# Altium schematic sheet Main.SchDoc
size A
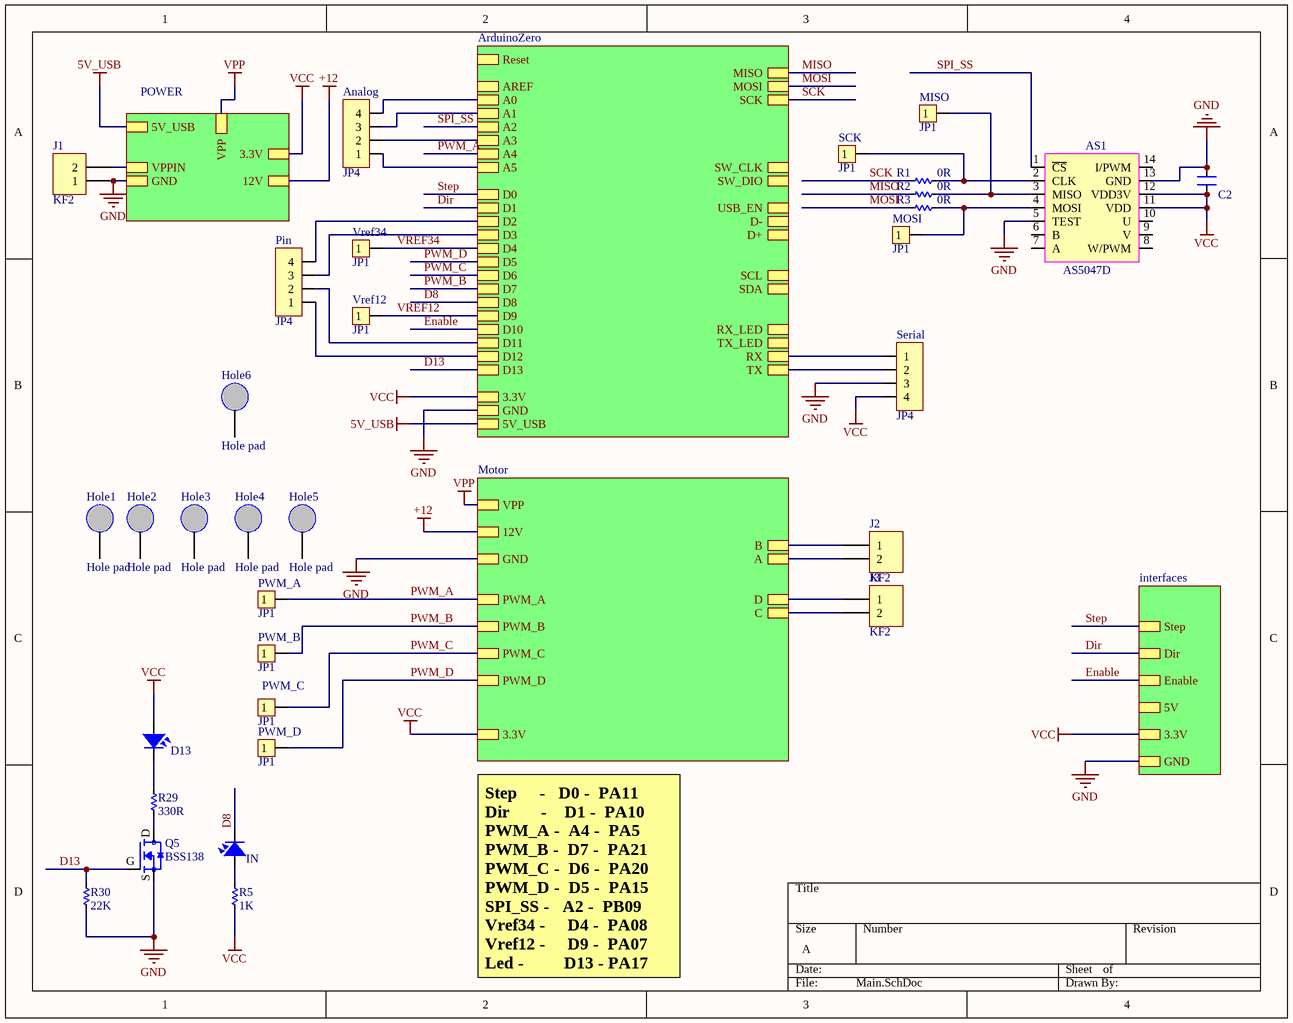
[diagram p0: Main.SchDoc]

## Parts
Analog  JP4  [JP4-C1T]
AS1  AS5047D  [AS5047D_Module]
C2  CN  [CN-SMD-0603_big]  (value not drawn)
D13  LED  [LED-0805-Blue]  (value not drawn)
Hole1  Hole pad  [HolePad]
Hole2  Hole pad  [HolePad]
Hole3  Hole pad  [HolePad]
Hole4  Hole pad  [HolePad]
Hole5  Hole pad  [HolePad]
Hole6  Hole pad  [HolePad]
IN  LED  [LED-0805-Blue]  (value not drawn)
J1  KF2  [KF2-5.08T]
J2  KF2  [KF2-5.08T]
J3  KF2  [KF2-5.08T]
MISO  JP1  [JP1-D1T]
MOSI  JP1  [JP1-D1T]
Pin  JP4  [JP4-C1T]
PWM_A  JP1  [JP1-D1T]
PWM_B  JP1  [JP1-D1T]
PWM_C  JP1  [JP1-D1T]
PWM_D  JP1  [JP1-D1T]
Q5  BSS138  [SOT23-bss138]
R1  0R  [RES-SMD-0603_BIG]
R2  0R  [RES-SMD-0603_BIG]
R3  0R  [RES-SMD-0603_BIG]
R5  1K  [RES-SMD-0603_BIG]
R29  330R  [RES-SMD-0603_BIG]
R30  22K  [RES-SMD-0603_BIG]
SCK  JP1  [JP1-D1T]
Serial  JP4  [JP4-C1T]
Vref12  JP1  [JP1-D1T]
Vref34  JP1  [JP1-D1T]

## Sub-sheets
ArduinoZero = ArduinoZero: Reset, A0, A1, A2, A3, A4, A5, D0, D1, D2, D3, D4, AREF, D5, D6, D7, D8, D9, D10, D11, D12, D13, TX, RX, TX_LED, RX_LED, SDA, SCL, 3.3V, GND, D+, D-, USB_EN, SW_DIO, SW_CLK, MISO, MOSI, SCK, 5V_USB
Interfaces = interfaces: Step, Dir, Enable, 5V, 3.3V, GND
Motor = Motor: VPP, 12V, GND, A, B, C, D, PWM_B, PWM_A, PWM_C, PWM_D, 3.3V
Power = POWER: 5V_USB, 3.3V, GND, VPPIN, 12V, VPP

## Nets
5V_USB: sheet ArduinoZero/5V_USB, sheet Power/5V_USB
+12: sheet Power/12V, sheet Motor/12V
GND: AS1.5(TEST) AS1.13(GND) C2.2 J1.1 Q5.S R30.1 Serial.3 ; sheet ArduinoZero/GND, sheet Interfaces/GND, sheet Power/GND, sheet Motor/GND
VCC: AS1.11(VDD) AS1.12(VDD3V) C2.1 D13.1 R5.2 Serial.4 ; sheet ArduinoZero/3.3V, sheet Interfaces/3.3V, sheet Power/3.3V, sheet Motor/3.3V
VPP: sheet Power/VPP, sheet Motor/VPP
D8: IN.2 ; sheet ArduinoZero/D8
D13: Q5.G R30.2 ; sheet ArduinoZero/D13
Dir: sheet ArduinoZero/D1, sheet Interfaces/Dir
Enable: sheet ArduinoZero/D10, sheet Interfaces/Enable
MISO: R2.2 ; sheet ArduinoZero/MISO
MOSI: R3.2 ; sheet ArduinoZero/MOSI
PWM_A: PWM_A.1 ; sheet ArduinoZero/A4, sheet Motor/PWM_A
PWM_B: PWM_B.1 ; sheet ArduinoZero/D7, sheet Motor/PWM_B
PWM_C: PWM_C.1 ; sheet ArduinoZero/D6, sheet Motor/PWM_C
PWM_D: PWM_D.1 ; sheet ArduinoZero/D5, sheet Motor/PWM_D
SCK: R1.2 ; sheet ArduinoZero/SCK
SPI_SS: AS1.1(~{CS}) ; sheet ArduinoZero/A2
Step: sheet ArduinoZero/D0, sheet Interfaces/Step
VREF12: Vref12.1 ; sheet ArduinoZero/D9
VREF34: Vref34.1 ; sheet ArduinoZero/D4
NetAnalog_1: Analog.1 ; sheet ArduinoZero/A5
NetAnalog_2: Analog.2 ; sheet ArduinoZero/A3
NetAnalog_3: Analog.3 ; sheet ArduinoZero/A1
NetAnalog_4: Analog.4 ; sheet ArduinoZero/A0
NetAS1_2: AS1.2(CLK) R1.1 SCK.1
NetAS1_3: AS1.3(MISO) MISO.1 R2.1
NetAS1_4: AS1.4(MOSI) MOSI.1 R3.1
NetD13_2: D13.2 R29.1
NetIN_1: IN.1 R5.1
NetJ1_2: J1.2 ; sheet Power/VPPIN
NetJ2_1: J2.1 ; sheet Motor/B
NetJ2_2: J2.2 ; sheet Motor/A
NetJ3_1: J3.1 ; sheet Motor/D
NetJ3_2: J3.2 ; sheet Motor/C
NetPin_1: Pin.1 ; sheet ArduinoZero/D12
NetPin_2: Pin.2 ; sheet ArduinoZero/D11
NetPin_3: Pin.3 ; sheet ArduinoZero/D3
NetPin_4: Pin.4 ; sheet ArduinoZero/D2
NetQ5_D: Q5.D R29.2
NetSerial_1: Serial.1 ; sheet ArduinoZero/RX
NetSerial_2: Serial.2 ; sheet ArduinoZero/TX

Not connected (* = marked no-connect by the designer): AS1 6(B) 7(A) 8(W/PWM) 9(V) 10(U) 14(I/PWM); Hole1 1; Hole2 1; Hole3 1; Hole4 1; Hole5 1; Hole6 1

## Notes on the sheet
- Step     -   D0 -  PA11
  Dir       -    D1 -  PA10
  PWM_A -  A4 -  PA5
  PWM_B -  D7 -  PA21
  PWM_C -  D6 -  PA20
  PWM_D -  D5 -  PA15
  SPI_SS -   A2 -  PB09
  Vref34 -     D4 -  PA08
  Vref12 -     D9 -  PA07
  Led -         D13 - PA17

## Library data of the parts
Analog Pin Serial = JP4: WR-PHD 2.54 mm Angled Socket Header; Manufacturer: W¨¹rth Elektronik eiSos GmbH; partNo: 613004143121; ComponentLink1 Description: Manufacturer; ComponentLink2 Description: Datasheet; NoPins: 04; Created Date: 29 March 2013; ComponentLink1URL: http://www.we-online.com; ComponentLink2URL: http://katalog.we-online.de/em/datasheet/6130xx143121.pdf; Created by: Karrer Zheng
AS1 = AS5047D: Manufacture_Parts: :AS5047D; ID: 37; Misfit Price: 0; Vendor: unknown; Voltage_Str: 0V; Watts_Str: 0W; Current_Str: A; Company_Part_GUID: altiumdb5786b44c08eb91.84503477; Component: AS5047D; Manufacturer_Part_Number: AS5047D; ComponentLink1Description: unknown; ComponentLink2Description: Datasheet; Voltage: 0; Watts: 0; Price: 0
C2 = CN: Value: 33pF
D13 IN = LED SMD: Value: LED 3 - 5 ly 2 Colour
J1-J3 = KF2: Manufacturer: Würth Elektronik eiSos GmbH; partNo: 691103110002; ComponentLink1 Description: Manufacturer; ComponentLink2 Description: Datasheet; NoPins: 2; Created Date: 29 October 2013; ComponentLink1URL: http://www.we-online.com; ComponentLink2URL: http://katalog.we-online.de/em/datasheet/6911031100xx.pdf; Created by: Karrer Zheng
MISO MOSI PWM_A PWM_B PWM_C PWM_D SCK Vref12 Vref34 = JP1: WR-PHD 2.54 mm Angled Socket Header; Manufacturer: W¨¹rth Elektronik eiSos GmbH; partNo: 613002143121; ComponentLink1 Description: Manufacturer; ComponentLink2 Description: Datasheet; NoPins: 02; Created Date: 29 March 2013; ComponentLink1URL: http://www.we-online.com; ComponentLink2URL: http://katalog.we-online.de/em/datasheet/6130xx143121.pdf; Created by: Karrer Zheng
Q5 = BSS138: N-Channel 50V 220mA _Ta_ 360mW _Ta_ Surface Mount Die; MF: MICROSS/On Semiconductor; Value: *; SnapEDA_Link: https://www.snapeda.com/parts/BSS138/MICROSS/On%20Semiconductor/view-part/2773844/?ref=snap; MP: BSS138; Availability: Unavailable; Price: None; Package: TO-236-3 Micross
R1-R3 R5 R29 R30 = R